# Altium schematic sheet ElderBot.SchDoc
size A; SheetNumber: 1; SheetTotal: 1
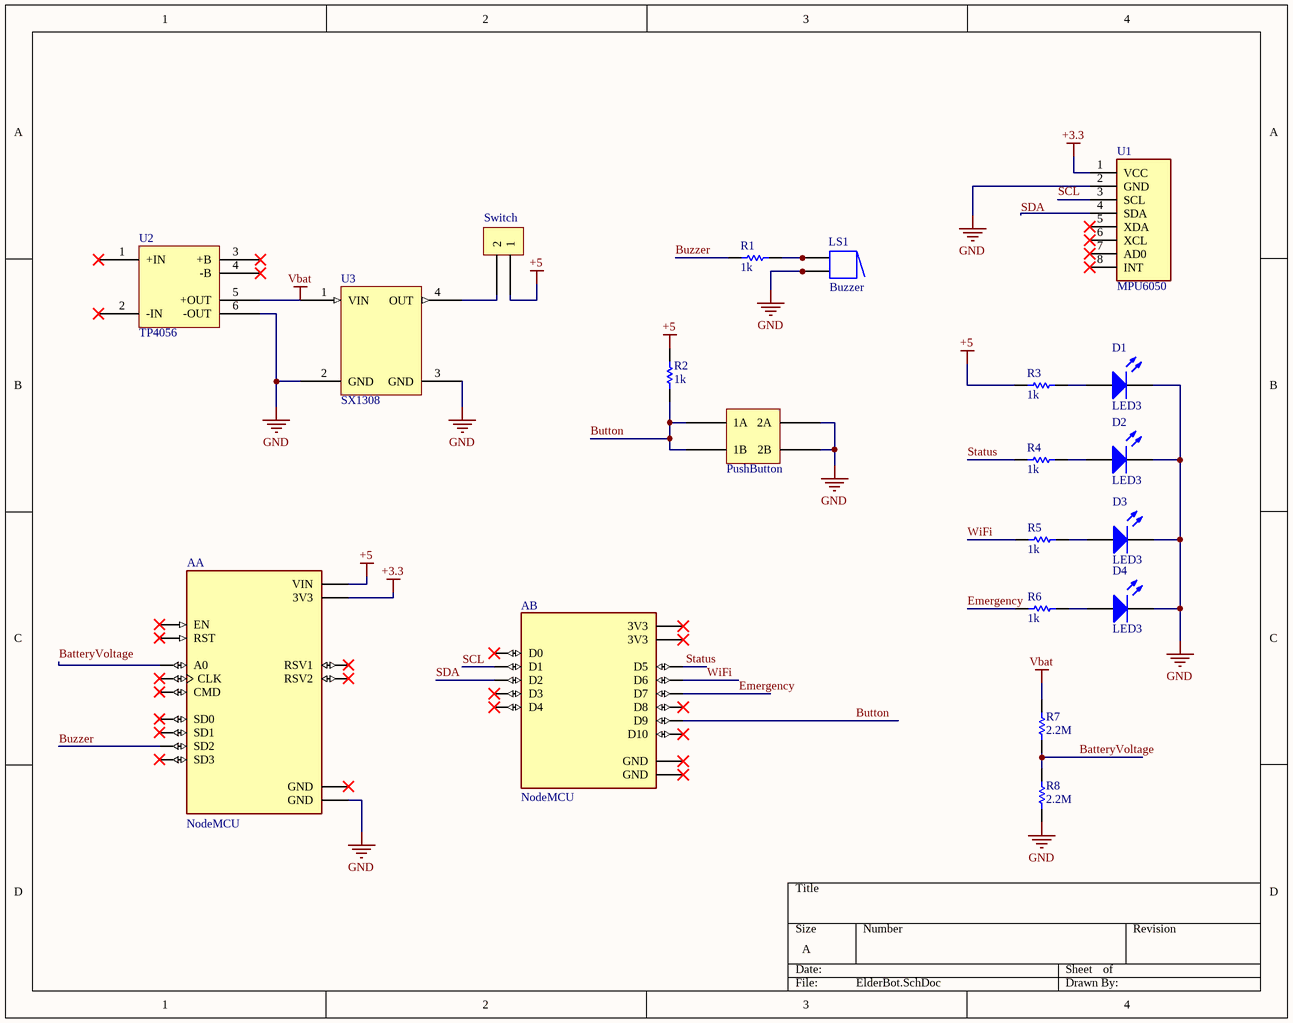
[diagram p0: ElderBot.SchDoc]

## Parts
A  NodeMCU  [SEEED_113990105]  (parts A,B of 2)
D1  LED3  [3.2X1.6X1.1]
D2  LED3  [3.2X1.6X1.1]
D3  LED3  [3.2X1.6X1.1]
D4  LED3  [3.2X1.6X1.1]
LS1  Buzzer  [Buzzer]
R1  value 1k  [RESC3116X70X50ML13T20]  (hidden comment: Resistor 1k +/-1% 1206 250 mW)
R2  value 1k  [RESC3116X70X50ML13T20]  (hidden comment: Resistor 1k +/-1% 1206 250 mW)
R3  value 1k  [RESC3116X70X50ML13T20]  (hidden comment: Resistor 1k +/-1% 1206 250 mW)
R4  value 1k  [RESC3116X70X50ML13T20]  (hidden comment: Resistor 1k +/-1% 1206 250 mW)
R5  value 1k  [RESC3116X70X50ML13T20]  (hidden comment: Resistor 1k +/-1% 1206 250 mW)
R6  value 1k  [RESC3116X70X50ML13T20]  (hidden comment: Resistor 1k +/-1% 1206 250 mW)
R7  value 2.2M  [RESC3116X70X50ML13T20]  (hidden comment: Resistor 1k +/-1% 1206 250 mW)
R8  value 2.2M  [RESC3116X70X50ML13T20]  (hidden comment: Resistor 1k +/-1% 1206 250 mW)
S1  Switch  [Switch]
S2  PushButton  [PushButton]
U1  MPU6050  [MPU6050]
U2  TP4056  [TP4056]
U3  SX1308  [SX1308]

## Nets
+3.3: A.J1_11(3V3) U1.1(VCC)
+5: A.J1_15(VIN) R2.2 R3.1 S1.1
GND: A.J1_14(GND) D1.2(K) D2.2(K) D3.2(K) D4.2(K) LS1.2 LS1.2A R8.1 S2.2A S2.2B U1.2(GND) U2.6(-OUT) U3.2(GND) U3.3(GND)
Vbat: R7.2 U2.5(+OUT) U3.1(VIN)
BatteryVoltage: A.J1_1(A0) R7.1 R8.2
Button: A.J2_12(D9) R2.1 S2.1A S2.1B
Buzzer: A.J1_5(SD2) R1.1
Emergency: A.J2_10(D7) R6.1
SCL: A.J2_2(D1) U1.3(SCL)
SDA: A.J2_3(D2) U1.4(SDA)
Status: A.J2_8(D5) R4.1
WiFi: A.J2_9(D6) R5.1
NetD1_1: D1.1(A) R3.2
NetD2_1: D2.1(A) R4.2
NetD3_1: D3.1(A) R5.2
NetD4_1: D4.1(A) R6.2
NetLS1_1: LS1.1 LS1.1A R1.2
NetS1_2: S1.2 U3.4(OUT)

Not connected (* = marked no-connect by the designer): A J1_2(RSV1)* J1_3(RSV2)* J1_4(SD3)* J1_6(SD1)* J1_7(CMD)* J1_8(SD0)* J1_9(CLK)* J1_10(GND)* J1_12(EN)* J1_13(RST)* J2_1(D0)* J2_4(D3)* J2_5(D4)* J2_6(3V3)* J2_7(GND)* J2_11(D8)* J2_13(D10)* J2_14(GND)* J2_15(3V3)*; U1 5(XDA)* 6(XCL)* 7(AD0)* 8(INT)*; U2 1(+IN)* 2(-IN)* 3(+B)* 4(-B)*

## Library data of the parts
A = 113990105: An open-source firmware and development kit that helps you to Prototype your IOT product within a few Lua script lines; MP: NodeMCU v2; MF: Seeed Technology; Availability: Unavailable; SnapEDA_Link: https://www.snapeda.com/parts/NodeMCU%20v2/Seeed%20Technology%20Co.%2C%20Ltd/view-part/378076/?ref=snap; Price: None; Value: *; Package: None
D1-D4 = LED3: Typical BLUE SiC LED; Published: 8-Jun-2000; LatestRevisionDate: 17-Dec-2003; LatestRevisionNote: PCB Footprint replaced.; DatasheetVersion: 16-Apr-2002; PackageVersion: 16-Apr-2002; PackageReference: 3.5X2.8X1.9; Publisher: Altium Limited; PackageDescription: SM LED; 2 C-Bend Leads; Body 3.5 x 2.8 x 1.9 mm, inc leads (LxWxH typ)
LS1 = Buzzer: Magnetic Transducer Buzzer; pin to pad: 1A>1 2A>2; Published: 24-Mar-1999; LatestRevisionDate: 17-Dec-2003; LatestRevisionNote: Schematic revised, PCB Footprint replaced.; DatasheetVersion: 17-Dec-2003; PackageReference: ABSM-1574; Publisher: Altium Limited; PackageDescription: Magnetic Transducer Buzzer; ComponentLink1Description: Manufacturer Link; ComponentLink1URL: http://www.megastar.com/linecard/buzzmode/index.php
R1-R8 = CMP-009-00011-5: Chip Resistor, 1 KOhm, +/- 1%, 0.25 W, -55 to 155 degC, 1206 (3216 Metric); Voltage Rating: 200V; Power: 250mW; Max Operating Temperature: 155°C; Mounting Technology: SM; Tolerance: 1%; Case/Package: 1206; RoHS Compliant: True; Min Operating Temperature: -55°C; Pins: 2
S2 = PushButton: pin to pad: 1A>1 1B>2 2A>3 2B>4